# Altium schematic sheet DAC_channel.SchDoc: DAC output
size 420 x 297 mm; EDA_Number: ARTIQ; Author: G.Kasprowicz; CompanyName: WUT ISE; DrawnBy: G.Kasprowicz; Organization: WUT ISE; Address1: PW ISE; Address2: Nowowiejska 15/19 00-665 Warsaw; Address3: gkasprow@gmail.com; DocumentNumber: 5; Revision: 1.0; SheetNumber: 5; SheetTotal: 7; ModifiedBy: -; CheckedDate: -; Title2: channel; DivGrp: WUT ISE; Designer: G.Kasprowicz; ModifiedDate: -; ProjectName: Sensor Box
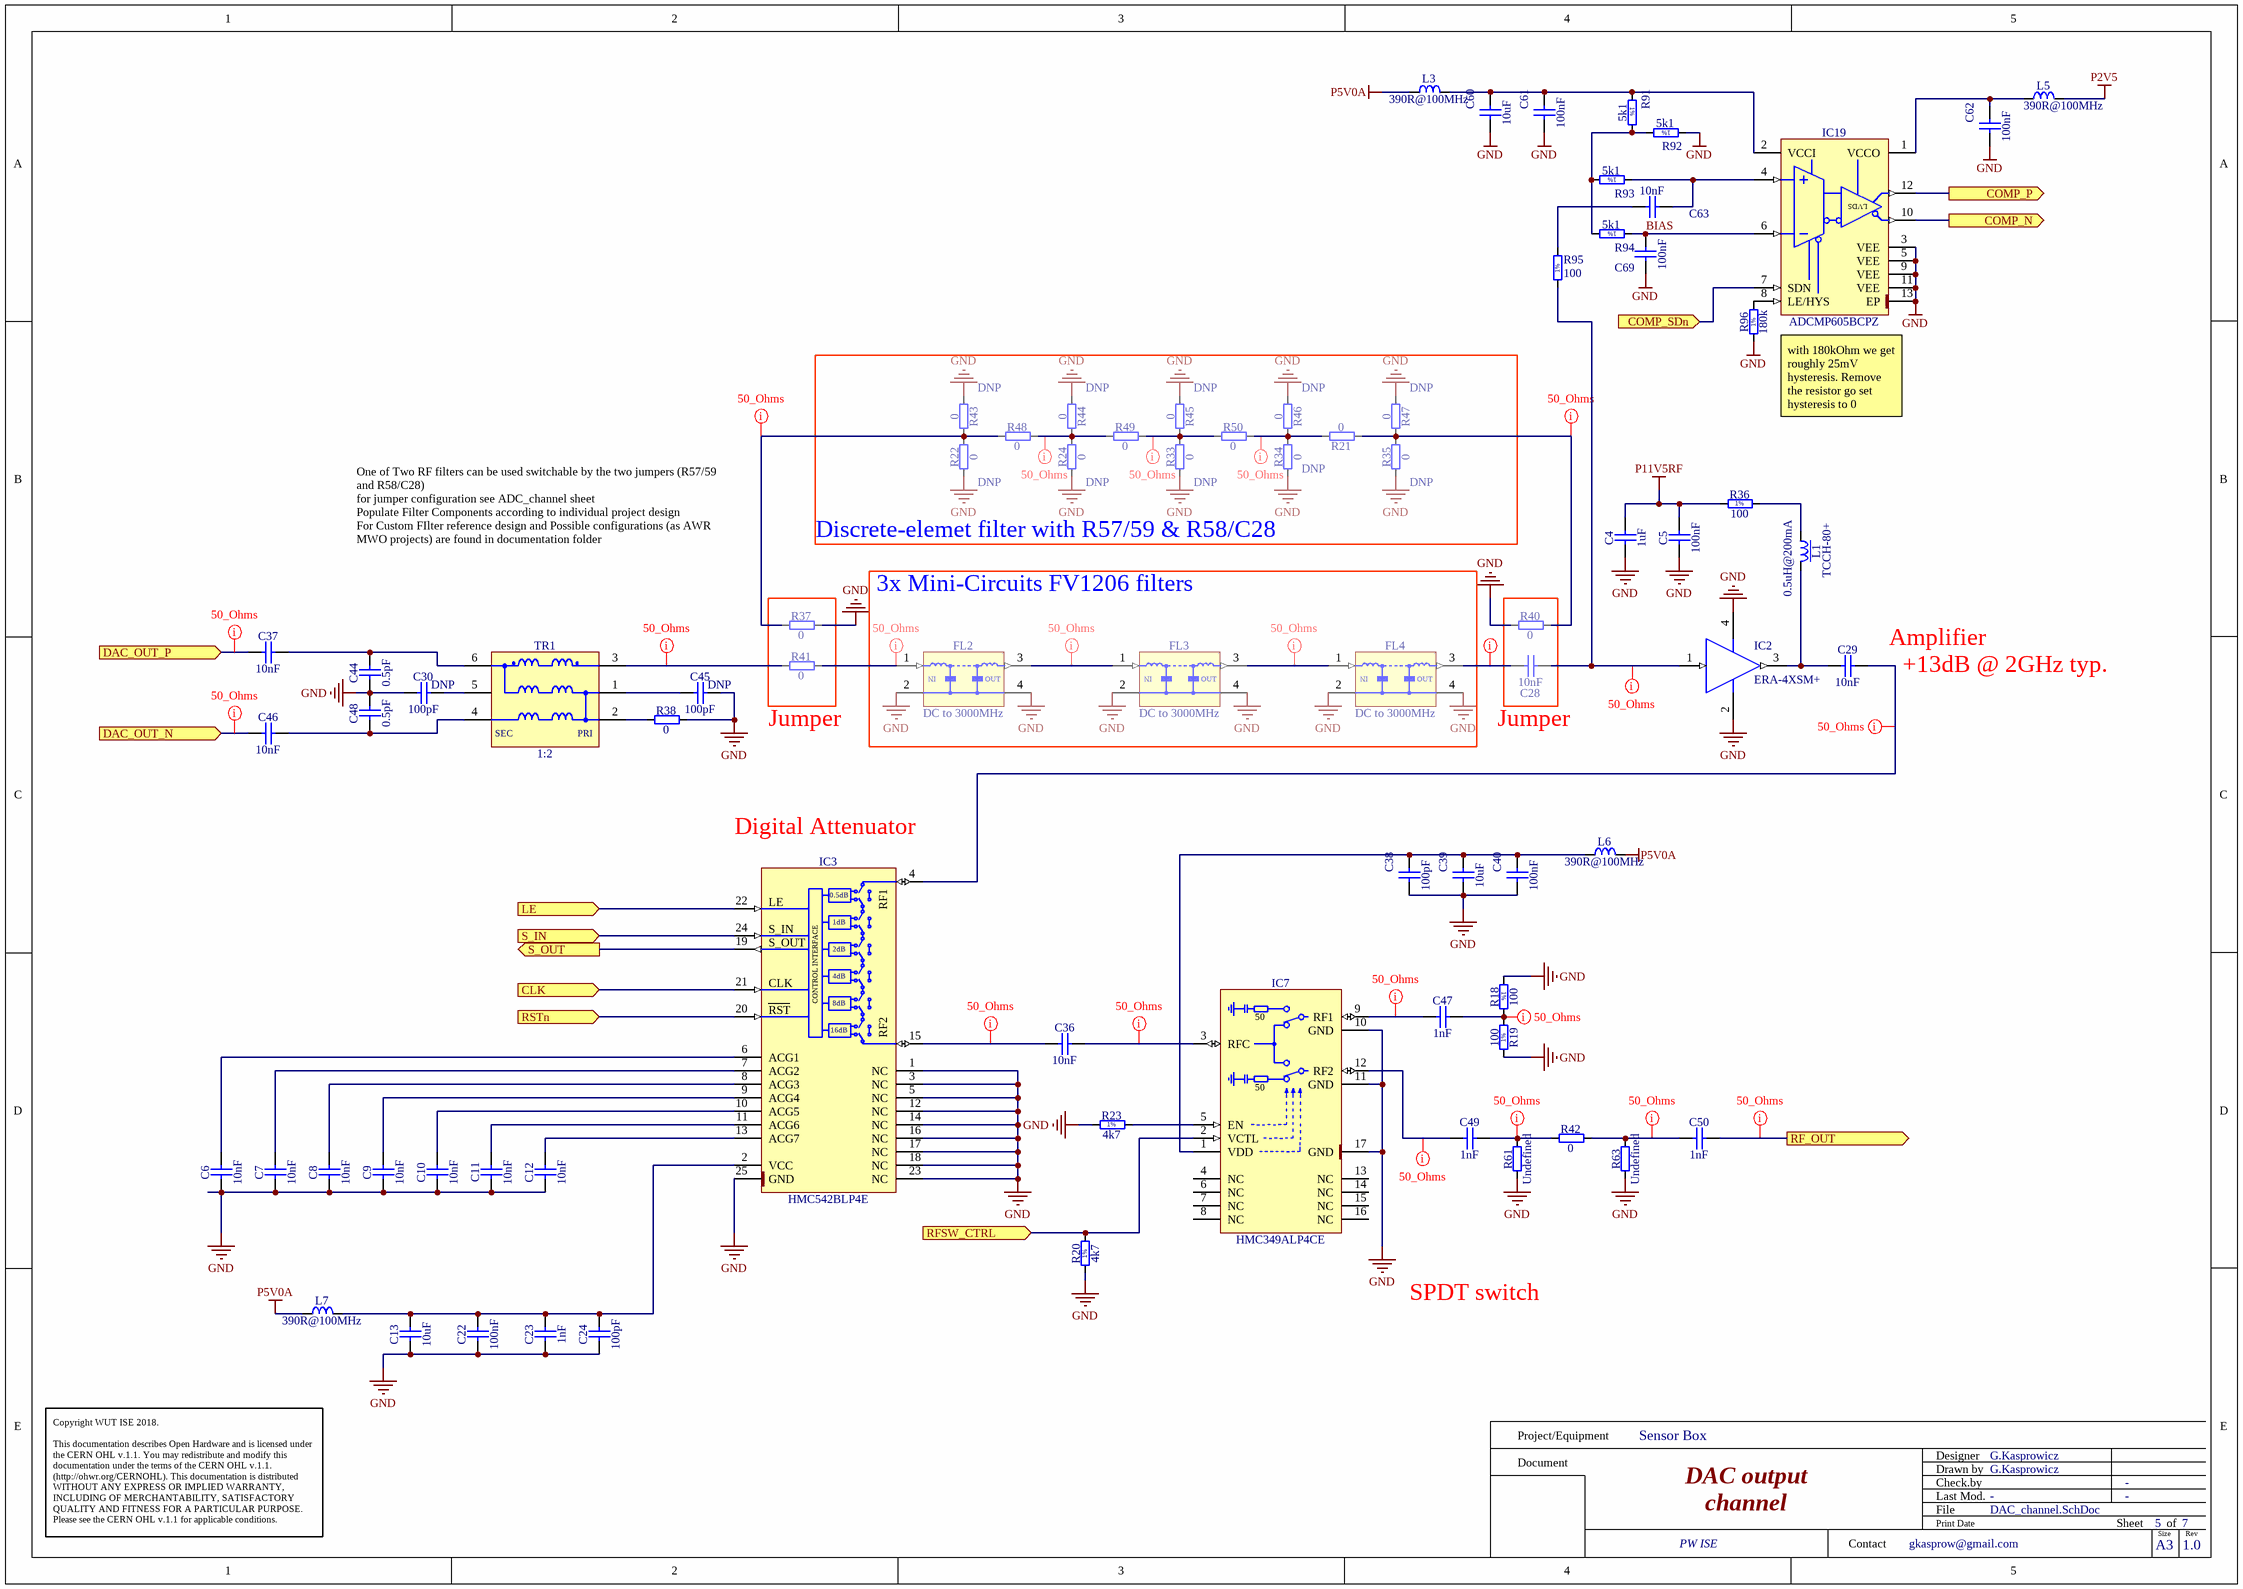
[diagram p0: DAC_channel.SchDoc]

## Parts
C4  1uF  [CAPC2012X140N]
C5  100nF  [CAPC1608X87N]
C6  10nF  [CAPC1005X55N]
C7  10nF  [CAPC1005X55N]
C8  10nF  [CAPC1005X55N]
C9  10nF  [CAPC1005X55N]
C10  10nF  [CAPC1005X55N]
C11  10nF  [CAPC1005X55N]
C12  10nF  [CAPC1005X55N]
C13  10uF  [CAPC1608X80N]
C22  100nF  [CAPC1005X55N]
C23  1nF  [CAPC1005X55N]
C24  100pF  [CAPC1005X55N]
C28  10nF  [CAPC1005X55N]
C29  10nF  [CAPC1005X55N]
C30  100pF  Mounted: DNP  [CAPC1005X55N]
C36  10nF  [CAPC1005X55N]
C37  10nF  [CAPC1005X55N]
C38  100pF  [CAPC1005X55N]
C39  10uF  [CAPC1608X80N]
C40  100nF  [CAPC1005X55N]
C44  0.5pF  [CAPC1005X50N]
C45  100pF  Mounted: DNP  [CAPC1005X55N]
C46  10nF  [CAPC1005X55N]
C47  1nF  [CAPC1005X55N]
C48  0.5pF  [CAPC1005X50N]
C49  1nF  [CAPC1005X55N]
C50  1nF  [CAPC1005X55N]
C60  10uF  [CAPC1608X80N]
C61  100nF  [CAPC1005X55N]
C62  100nF  [CAPC1005X55N]
C63  10nF  [CAPC1005X55N]
C69  100nF  [CAPC1005X55N]
FL2  DC to 3000MHz  [FIL_MINI-CIRCUITS_FV1206]
FL3  DC to 3000MHz  [FIL_MINI-CIRCUITS_FV1206]
FL4  DC to 3000MHz  [FIL_MINI-CIRCUITS_FV1206]
IC2  ERA-4XSM+  [MINI-CIRCUITS_WW107]
IC3  HMC542BLP4E  [QFN50P400X400X100-25N-S295]
IC7  HMC349ALP4CE  [QFN65P400X400X100-17N-S255]
IC19  ADCMP605BCPZ  [QFN50P300X300X100-13N-S145]
L1  0.5uH@200mA  Manufacturer Part Number: TCCH-80+  [IND_MINI-CIRCUITS_GU1604]
L3  390R@100MHz  [INDC1608X95N]
L5  390R@100MHz  [INDC1608X95N]
L6  390R@100MHz  [INDC1608X95N]
L7  390R@100MHz  [INDC1608X95N]
R18  100  [RESC1005X40N]
R19  100  [RESC1005X40N]
R20  4k7  [RESC1005X40N]
R21  0  [RESC1005X40N]
R22  0  Mounted: DNP  [RESC1005X40N]
R23  4k7  [RESC1005X40N]
R24  0  Mounted: DNP  [RESC1005X40N]
R33  0  Mounted: DNP  [RESC1005X40N]
R34  0  Mounted: DNP  [RESC1005X40N]
R35  0  Mounted: DNP  [RESC1005X40N]
R36  100  [RESC3146X65N]
R37  0  [RESC1005X40N]
R38  0  [RESC1005X40N]
R40  0  [RESC1005X40N]
R41  0  [RESC1005X40N]
R42  0  [RESC1608X55N]
R43  0  Mounted: DNP  [RESC1005X40N]
R44  0  Mounted: DNP  [RESC1005X40N]
R45  0  Mounted: DNP  [RESC1005X40N]
R46  0  Mounted: DNP  [RESC1005X40N]
R47  0  Mounted: DNP  [RESC1005X40N]
R48  0  [RESC1005X40N]
R49  0  [RESC1005X40N]
R50  0  [RESC1005X40N]
R61  Undefined  [RESC1608X55N]
R63  Undefined  [RESC1608X55N]
R91  5k1  [RESC1005X40N]
R92  5k1  [RESC1005X40N]
R93  5k1  [RESC1005X40N]
R94  5k1  [RESC1005X40N]
R95  100  [RESC1005X40N]
R96  180k  [RESC1005X40N]
TR1  1:2  [XFMR_MINI-CIRCUITS_DB1627]

## Blocks framed on the sheet
Discrete-elemet filter with R57/59 & R58/C28: R21 R22 R24 R33-R35 R43-R50
3x Mini-Circuits FV1206 filters: FL2-FL4

## Ports
CLK (in), COMP_N (out), COMP_P (out), COMP_SDn (in), DAC_OUT_N (in), DAC_OUT_P (in), LE (in), RF_OUT (out), RFSW_CTRL (in), RSTn (in), S_IN (in), S_OUT (out)

## Nets
GND: C4.1 C5.1 C6.1 C7.1 C8.1 C9.1 C10.1 C11.1 C12.1 C13.1 C22.1 C23.1 C24.1 C30.1 C38.2 C39.1 C40.1 C44.1 C45.2 C48.2 C60.1 C61.1 C62.1 C69.1 FL2.2(GND) FL2.4(GND) FL3.2(GND) FL3.4(GND) FL4.2(GND) FL4.4(GND) IC2.2(GND) IC2.4(GND) IC3.1(NC) IC3.3(NC) IC3.5(NC) IC3.12(NC) IC3.14(NC) IC3.16(NC) IC3.17(NC) IC3.18(NC) IC3.23(NC) IC3.25(GND) IC7.10(GND) IC7.11(GND) IC7.17(GND) IC19.3(VEE) IC19.5(VEE) IC19.9(VEE) IC19.11(VEE) IC19.13(EP) R18.1 R19.1 R20.1 R22.1 R23.1 R24.1 R33.1 R34.1 R35.1 R37.2 R38.2 R40.2 R43.1 R44.1 R45.1 R46.1 R47.1 R61.1 R63.1 R92.1 R96.1
P2V5: L5.2
P5V0A: L3.1 L6.2 L7.1
P11V5RF: C4.2 C5.2 R36.1
BIAS: C69.2 IC19.6(VN) R94.1
CLK: IC3.21(SHIFT_CLOCK) ; port CLK
COMP_N: IC19.10(~{Q}) ; port COMP_N
COMP_P: IC19.12(Q) ; port COMP_P
COMP_SDn: IC19.7(SDN) ; port COMP_SDn
DAC_OUT_N: C46.1 ; port DAC_OUT_N
DAC_OUT_P: C37.1 ; port DAC_OUT_P
LE: IC3.22(LATCH_ENABLE) ; port LE
RF_OUT: C50.2 ; port RF_OUT
RFSW_CTRL: IC7.2(VCTL) R20.2 ; port RFSW_CTRL
RSTn: IC3.20(~{RESET}) ; port RSTn
S_IN: IC3.24(SERIAL_INPUT) ; port S_IN
S_OUT: IC3.19(SERIAL_OUTPUT) ; port S_OUT
NetC6_2: C6.2 IC3.6(ACG1)
NetC7_2: C7.2 IC3.7(ACG2)
NetC8_2: C8.2 IC3.8(ACG3)
NetC9_2: C9.2 IC3.9(ACG4)
NetC10_2: C10.2 IC3.10(ACG5)
NetC11_2: C11.2 IC3.11(ACG6)
NetC12_2: C12.2 IC3.13(ACG7)
NetC13_2: C13.2 C22.2 C23.2 C24.2 IC3.2(VCC) L7.2
NetC28_1: C28.1 FL4.3(RFOUT)
NetC28_2: C28.2 IC2.1(RF_IN) R95.1
NetC29_1: C29.1 IC2.3(RF_OUT) L1.3
NetC29_2: C29.2 IC3.4(RF1)
NetC30_2: C30.2 TR1.5(NC)
NetC36_1: C36.1 IC3.15(RF2)
NetC36_2: C36.2 IC7.3(RFC)
NetC37_2: C37.2 C44.2 TR1.6(S1)
NetC38_1: C38.1 C39.2 C40.2 IC7.1(VDD) L6.1
NetC45_1: C45.1 TR1.1(P1)
NetC46_2: C46.2 C48.1 TR1.4(S1)
NetC47_1: C47.1 IC7.9(RF1)
NetC47_2: C47.2 R18.2 R19.2
NetC49_1: C49.1 IC7.12(RF2)
NetC49_2: C49.2 R42.1 R61.2
NetC50_1: C50.1 R42.2 R63.2
NetC60_2: C60.2 C61.2 IC19.2(VCCI) L3.2 R91.1
NetC62_2: C62.2 IC19.1(VCCO) L5.1
NetC63_1: C63.1 IC19.4(VP) R93.1
NetC63_2: C63.2 R95.2
NetFL2_1: FL2.1(RFIN) R41.2
NetFL2_3: FL2.3(RFOUT) FL3.1(RFIN)
NetFL3_3: FL3.3(RFOUT) FL4.1(RFIN)
NetIC7_5: IC7.5(EN) R23.2
NetIC19_8: IC19.8(LE/HYS) R96.2
NetL1_1: L1.1 R36.2
NetR21_1: R21.1 R35.2 R40.1 R47.2
NetR21_2: R21.2 R34.2 R46.2 R50.2
NetR22_2: R22.2 R37.1 R43.2 R48.1
NetR24_2: R24.2 R44.2 R48.2 R49.1
NetR33_2: R33.2 R45.2 R49.2 R50.1
NetR38_1: R38.1 TR1.2(P1)
NetR41_1: R41.1 TR1.3(P1)
NetR91_2: R91.2 R92.2 R93.2 R94.2

Not connected (* = marked no-connect by the designer): IC7 4(NC) 6(NC) 7(NC) 8(NC) 13(NC) 14(NC) 15(NC) 16(NC)

## Layout directives
net class 50_Ohms: DAC_OUT_N, DAC_OUT_P, NetC28_1, NetC28_2, NetC29_2, NetC36_1, NetC36_2, NetC47_1, NetC47_2, NetC49_1, NetC49_2, NetC50_1, NetFL2_1, NetFL2_3, NetFL3_3, NetR21_1, NetR21_2, NetR22_2, NetR24_2, NetR33_2, NetR41_1, RF_OUT

## Notes on the sheet
- with 180kOhm we get roughly 25mV hysteresis. Remove the resistor go set hysteresis to 0
- One of Two RF filters can be used switchable by the two jumpers (R57/59 and R58/C28)
  for jumper configuration see ADC_channel sheet
  Populate Filter Components according to individual project design
  For Custom FIlter reference design and Possible configurations (as AWR MWO projects) are found in documentation folder
- (near C29) Amplifier
- Jumper
- (near C29) +13dB @ 2GHz typ.
- (near IC3) Digital Attenuator
- SPDT switch
- Project/Equipment
- Document
- Designer
- Drawn by
- Check.by
- Copyright WUT ISE 2018.
  This documentation describes Open Hardware and is licensed under the CERN OHL v.1.1. You may redistribute and modify this documentation under the terms of the CERN OHL v.1.1. (http://ohwr.org/CERNOHL). This documentation is distributed WITHOUT ANY EXPRESS OR IMPLIED WARRANTY, INCLUDING OF MERCHANTABILITY, SATISFACTORY QUALITY AND FITNESS FOR A PARTICULAR PURPOSE. Please see the CERN OHL v.1.1 for applicable conditions.
- Contact
- File
- Last Mod.
- Print Date
- Sheet
- Size
- A3
- of
- Rev
- (in symbol ADCMP605BCPZ) LVDS
- (in symbol FIL_MINI-CIRCUITS_LFCN-3000+) IN; OUT
- (in symbol HMC349ALP4CE) 50
- (in symbol HMC542BLP4E) 0.5dB; LE; 1dB; S_IN; S_OUT; 2dB; CONTROL INTERFACE; 4dB; CLK; 8dB; RST; 16dB
- (in symbol R0402_4K7_1%_0.0625W_100PPM) 1%
- (in symbol R0402_5K1_1%_0.0625W_100PPM) 1%
- (in symbol R0402_100R_1%_0.1W_100PPM) 1%
- (in symbol R0402_100R_1%_0.0625W_100PPM) 1%
- (in symbol R0402_180K_1%_0.0625W_100PPM) 1%
- (in symbol R1218_100R_1%_1W_100PPM) 1%
- (in symbol XFMR_MINI-CIRCUITS_TCM2-43X+) SEC; PRI

## Library data of the parts
C4 = CC0805_1UF_35V_20%_X7R: Non-polarised capacitor; Part Description: SMD Multilayer Chip Ceramic Capacitor; Manufacturer: GENERIC; Manufacturer1 Part Number: GMK212B7105MG-T; Voltage: 35V; TC: X7R; Tolerance: ±20%; Part Number: CC0805_1UF_35V_20%_X7R; Component Kind: Standard; Component Type: Standard; Pin Count: 2; Value: 1uF; Status: Not Recommended; Manufacturer Part Number: CC0805_1UF_35V_20%_X7R; Case: 0805; Mounted: Yes; Socket: No; SMD: Yes; Sense: No; Manufacturer1 Example: TAIYO YUDEN; Manufacturer1 ComponentHeight: 1.35mm; HelpURL: \\cern.ch\dfs\Applications\Altium\Datasheets\CC0805_X7R_TAIYO-YUDEN_HIGH-VALUE.pdf; Author: CERN DEM JLC; CreateDate: 2011-06-22; LatestRevisionDate: 2011-06-22
C5 = CC0603_100NF_50V_10%_X7R: Non-polarised capacitor; Part Description: SMD Multilayer Chip Ceramic Capacitor; Manufacturer: GENERIC; Manufacturer1 Part Number: 223858615649; Voltage: 50V; TC: X7R; Tolerance: ±10%; Part Number: CC0603_100NF_50V_10%_X7R; Component Kind: Standard; Component Type: Standard; Pin Count: 2; Value: 100nF; Status: Preferred; Manufacturer Part Number: CC0603_100NF_50V_10%_X7R; Case: 0603; Mounted: Yes; Socket: No; SMD: Yes; Sense: No; Manufacturer1 Example: PHYCOMP; Manufacturer1 ComponentHeight: 0.87mm; HelpURL: \\cern.ch\dfs\Applications\Altium\Datasheets\CC0603_X7R_PHYCOMP.pdf; Author: CERN DEM JLC; CreateDate: 2007-12-03; LatestRevisionDate: 2007-12-03
C6-C12 C28 C29 C36 C37 C46 C63 = CC0402_10NF_16V_10%_X7R: Non-polarised capacitor; Part Description: SMD Multilayer Chip Ceramic Capacitor; Manufacturer: GENERIC; Manufacturer1 Part Number: 223878715636; Voltage: 16V; TC: X7R; Tolerance: ±10%; Part Number: CC0402_10NF_16V_10%_X7R; Component Kind: Standard; Component Type: Standard; Pin Count: 2; Value: 10nF; Status: Not Recommended; Manufacturer Part Number: CC0402_10NF_16V_10%_X7R; Case: 0402; Mounted: Yes; Socket: No; SMD: Yes; Sense: No; Manufacturer1 Example: PHYCOMP; Manufacturer1 ComponentHeight: 0.55mm; HelpURL: \\cern.ch\dfs\Applications\Altium\Datasheets\CC0402_X7R_PHYCOMP.pdf; Author: CERN DEM JLC; CreateDate: 2007-12-03; LatestRevisionDate: 2007-12-03
C13 C39 C60 = CC0603_10UF_16V_20%_X5R: Non-polarised capacitor; Part Description: SMD Multilayer Chip Ceramic Capacitor; Manufacturer: GENERIC; Manufacturer1 Part Number: GRM188R61C106MA73D; Voltage: 16V; TC: X5R; Tolerance: ±20%; Part Number: CC0603_10UF_16V_20%_X5R; Component Kind: Standard; Component Type: Standard; Pin Count: 2; Value: 10uF; Status: None; Manufacturer Part Number: CC0603_10UF_16V_20%_X5R; Case: 0603; Mounted: Yes; Socket: No; SMD: Yes; Sense: No; Manufacturer1 Example: MURATA; Manufacturer1 ComponentHeight: 0.8mm; HelpURL: \\cern.ch\dfs\Applications\Altium\Datasheets\CC0603_X5R_MURATA_GRM.pdf; Author: CERN DEM MR; CreateDate: 2016-03-02; LatestRevisionDate: 2016-03-02
C22 C40 C61 C62 C69 = CC0402_100NF_16V_10%_X7R: Non-polarised capacitor; Part Description: SMD Multilayer Chip Ceramic Capacitor; Manufacturer: GENERIC; Manufacturer1 Part Number: GRM155R71C104KA88D; Voltage: 16V; TC: X7R; Tolerance: ±10%; Part Number: CC0402_100NF_16V_10%_X7R; Component Kind: Standard; Component Type: Standard; Pin Count: 2; Value: 100nF; Status: Not Recommended; Manufacturer Part Number: CC0402_100NF_16V_10%_X7R; Case: 0402; Mounted: Yes; Socket: No; SMD: Yes; Sense: No; Manufacturer1 Example: MURATA; Manufacturer1 ComponentHeight: 0.55mm; HelpURL: \\cern.ch\dfs\Applications\Altium\Datasheets\CC0402_X7R_MURATA_GRM.pdf; Author: CERN DEM JLC; CreateDate: 2013-12-05; LatestRevisionDate: 2007-12-03
C23 C47 C49 C50 = CC0402_1NF_50V_10%_X7R: Non-polarised capacitor; Part Description: SMD Multilayer Chip Ceramic Capacitor; Manufacturer: GENERIC; Manufacturer1 Part Number: 223858715623; Voltage: 50V; TC: X7R; Tolerance: ±10%; Part Number: CC0402_1NF_50V_10%_X7R; Component Kind: Standard; Component Type: Standard; Pin Count: 2; Value: 1nF; Status: Not Recommended; Manufacturer Part Number: CC0402_1NF_50V_10%_X7R; Case: 0402; Mounted: Yes; Socket: No; SMD: Yes; Sense: No; Manufacturer1 Example: PHYCOMP; Manufacturer1 ComponentHeight: 0.55mm; HelpURL: \\cern.ch\dfs\Applications\Altium\Datasheets\CC0402_X7R_PHYCOMP.pdf; Author: CERN DEM JLC
  C23: CreateDate: 2007-12-03; LatestRevisionDate: 2007-12-03
  C47 C49 C50: CreateDate: 03.12.2007; LatestRevisionDate: 03.12.2007
C24 C30 C38 C45 = CC0402_100PF_50V_5%_C0G: Non-polarised capacitor; Part Description: SMD Multilayer Chip Ceramic Capacitor; Manufacturer: GENERIC; Manufacturer1 Part Number: C0402C101J5GACTU; Voltage: 50V; TC: C0G/NP0; Tolerance: ±5%; Part Number: CC0402_100PF_50V_5%_C0G; Component Kind: Standard; Component Type: Standard; Pin Count: 2; Value: 100pF; Status: Preferred; Manufacturer Part Number: CC0402_100PF_50V_5%_C0G; Case: 0402; Socket: No; SMD: Yes; Sense: No; Manufacturer1 Example: KEMET; Manufacturer1 ComponentHeight: 0.55mm; HelpURL: \\cern.ch\dfs\Applications\Altium\Datasheets\CC0805_C0G_KEMET_(Commercial Grade).pdf; Author: CERN DEM JLC; CreateDate: 2007-12-03; LatestRevisionDate: 2015-04-22
  C24 C38: Mounted: Yes
C44 C48 = CC0402_0.5PF_25V_0.05PF_AVX_04023J0R5ABSTR: Non-polarised capacitor; Part Description: Thin-Film Chip Capacitors for RF Signal and Power Applications, Accu-P Series; Manufacturer: AVX; Voltage: 25V; Tolerance: ±0.05pF; Part Number: CC0402_0.5PF_25V_0.05PF_AVX_04023J0R5ABSTR; Component Kind: Standard; Component Type: Standard; Pin Count: 2; Value: 0.5pF; Status: None; Manufacturer Part Number: 04023J0R5ABSTR; Case: 0402; Mounted: Yes; Socket: No; SMD: Yes; Sense: No; ComponentHeight: 0.5mm; HelpURL: \\cern.ch\dfs\Applications\Altium\Datasheets\CC0402_AVX_ACCU-P.pdf; Author: CERN DEM JLC; CreateDate: 22.02.2017; LatestRevisionDate: 22.02.2017
FL2-FL4 = FIL_MINI-CIRCUITS_LFCN-3000+: 50 Ohm DC to 3000MHz Low Pass Filter; Part Description: 50 Ohm Low Pass Filter; Part Number: FIL_MINI-CIRCUITS_LFCN-3000+; Component Kind: Standard; Component Type: Standard; Pin Count: 2; Value: DC to 3000MHz; Status: None; Manufacturer: MINI-CIRCUITS; Manufacturer Part Number: LFCN-3000+; Mounted: Yes; Socket: No; SMD: Yes; Sense: No; ComponentHeight: 0.94mm; HelpURL: \\cern.ch\dfs\Applications\Altium\Datasheets\FIL_MINI-CIRCUITS_LFCN-3000+.pdf; Author: CERN DEM JLC; CreateDate: 2013-12-09; LatestRevisionDate: 2013-12-09
IC2 = ERA-4XSM+: DC-4GHz Monolithic Amplifier; Manufacturer: MINI-CIRCUITS; PressFit: No; Bonding: No; Part Number: ERA-4XSM+; Component Kind: Standard; Component Type: Standard; Device: ERA-4XSM+; PackageDescription: MINI-CIRCUITS WW107 Case, Body 2.16mm Diameter X 1.52mm H; Part Description: DC-4GHz Monolithic Amplifier; Manufacturer Part Number: ERA-4XSM+; Pin Count: 4; Mounted: Yes; Socket: No; SMD: Yes; Sense: No; ComponentHeight: 1.52mm; Author: CERN DEM JMW; HelpURL: \\cern.ch\dfs\Applications\Altium\Datasheets\ERA-4XSM+.pdf; CreateDate: 11.08.2016; LatestRevisionDate: 11.08.2016
IC3 = HMC542BLP4E: 0.5dB LSB GaAs MMIC 6-bit Digital Serial Control Attenuator, DC - 4GHz; Part Description: 0.5dB LSB GaAs MMIC 6-bit Digital Serial Control Attenuator, DC to 4GHz; Manufacturer: HITTITE MICROWAVE CORP; PressFit: No; Bonding: No; Part Number: HMC542BLP4E; Component Kind: Standard; Component Type: Standard; Device: HMC542BLP4E; PackageDescription: QFN, 0.50mm Pitch, Square; 24 Pin, 4.00mm L X 4.00mm W X 1.00mm H Body (w/thermal Tab 2.95 X 2.95mm), IPC Medium Density; Manufacturer Part Number: HMC542BLP4E; Pin Count: 25; Case: QFN24; Mounted: Yes; Socket: No; SMD: Yes; Sense: No; ComponentHeight: 1mm; Author: CERN DEM JMW; HelpURL: \\cern.ch\dfs\Applications\Altium\Datasheets\HMC542BLP4E.pdf; CreateDate: 2016-08-17; LatestRevisionDate: 2016-08-17
IC7 = HMC349ALP4CE: DC-4GHz High Isolation SPDT Non-Reflective Switch; Manufacturer: ANALOG DEVICES; PressFit: No; Bonding: No; Part Number: HMC349ALP4CE; Component Kind: Standard; Component Type: Standard; Device: HMC349ALP4CE; PackageDescription: QFN, 0.65mm pitch,square; 4 pin X 4 pin, 4mm X 4mm X 1mm H body (w/thermal tab 2.55 X 2.55mm),  IPC Medium Density; Part Description: DC-4GHz High Isolation SPDT Non-Reflective Switch; Manufacturer Part Number: HMC349ALP4CE; Pin Count: 17; Case: QFN16; Mounted: Yes; Socket: No; SMD: Yes; Sense: No; ComponentHeight: 1mm; Author: CERN DEM JLC; HelpURL: \\cern.ch\dfs\Applications\Altium\Datasheets\HMC349ALP4CE.pdf; CreateDate: 2017-02-23; LatestRevisionDate: 2017-02-23
IC19 = ADCMP605BCPZ: Rail-to-Rail, Very Fast, 2.5 V to 5.5 V Single-Supply LVDS Comparators; Manufacturer: ANALOG DEVICES; PressFit: No; Bonding: No; Part Number: ADCMP605BCPZ; Component Kind: Standard; Component Type: Standard; Device: ADCMP605BCPZ; PackageDescription: QFN,0.50mm pitch,square;12 pin,3.00mm L X 3.00mm W X 1.00mm H body (w/Thermal Tab 1.45 X 1.45mm),  IPC Medium Density; Part Description: Rail-to-Rail, Very Fast, 2.5V to 5.5V Single-Supply LVDS Comparators; Manufacturer Part Number: ADCMP605BCPZ; Pin Count: 13; Case: QFN12; Mounted: Yes; Socket: No; SMD: Yes; Sense: No; ComponentHeight: 1.0mm; Author: CERN DEM JLC; HelpURL: \\cern.ch\dfs\Applications\Altium\Datasheets\ADCMP605BCPZ.pdf; CreateDate: 01.06.2011; LatestRevisionDate: 13.12.2011
L1 = IND_MINI-CIRCUITS_TCCH-80+: 50 Ohms, 50 to 8200 MHz RF Choke; Power: 200mA; Resistance: 0.1R; Part Number: IND_MINI-CIRCUITS_TCCH-80+; Component Kind: Standard; Component Type: Standard; Pin Count: 4; Value: 0.5uH@200mA; Status: None; Part Description: 50 Ohms, 50 to 8200 MHz RF Choke; Manufacturer: MINI-CIRCUITS; Mounted: Yes; Socket: No; SMD: Yes; Sense: No; ComponentHeight: 3.81mm; HelpURL: \\cern.ch\dfs\Applications\Altium\Datasheets\IND_MINI-CIRCUITS_TCCH-80+.pdf; Author: CERN DEM JLC; CreateDate: 2011-12-19; LatestRevisionDate: 2011-12-19
L3 L5-L7 = IND0603_TDK_MPZ1608R391A: Inductor; Part Description: SMT Chip Bead for Power Line; Manufacturer: TDK; Power: 1.2A; Resistance: 0.12R; Tolerance: ±25%; Part Number: IND0603_TDK_MPZ1608R391A; Component Kind: Standard; Component Type: Standard; Pin Count: 2; Value: 390R@100MHz; Status: None; Manufacturer Part Number: MPZ1608R391A; Case: 0603; Mounted: Yes; Socket: No; SMD: Yes; Sense: No; ComponentHeight: 0.95mm; HelpURL: \\cern.ch\dfs\Applications\Altium\Datasheets\IND0603_TDK_MPZ1608.pdf; Author: CERN DEM JLC; CreateDate: 2009-12-02; LatestRevisionDate: 2009-12-02
R18 R19 = R0402_100R_1%_0.0625W_100PPM: Resistor - 1%; Part Description: General Purpose Thick Film Chip Resistor; Manufacturer: GENERIC; Manufacturer1 Part Number: 232270671001L; TC: ±100ppm/°C; PressFit: No; Part Number: R0402_100R_1%_0.0625W_100PPM; Component Kind: Standard; Component Type: Standard; Pin Count: 2; Value: 100; Status: Not Recommended; Power: 0.0625W; Tolerance: ±1%; Manufacturer Part Number: R0402_100R_1%_0.0625W_100PPM; Case: 0402; Mounted: Yes; Sense: No; Socket: No; SMD: Yes; Manufacturer1 Example: YAGEO PHYCOMP; Manufacturer1 ComponentHeight: 0.4mm; HelpURL: \\cern.ch\dfs\Applications\Altium\Datasheets\R0402_Phycomp_RC0402.pdf; Author: CERN DEM JLC; CreateDate: 03.12.2007; LatestRevisionDate: 17.10.2012
R20 R23 = R0402_4K7_1%_0.0625W_100PPM: Resistor - 1%; Part Description: General Purpose Thick Film Chip Resistor; Manufacturer: GENERIC; Manufacturer1 Part Number: 232270674702L; TC: ±100ppm/°C; Part Number: R0402_4K7_1%_0.0625W_100PPM; Component Kind: Standard; Component Type: Standard; Pin Count: 2; Value: 4k7; Status: Not recommended; Power: 0.0625W; Tolerance: ±1%; Manufacturer Part Number: R0402_4K7_1%_0.0625W_100PPM; Case: 0402; Mounted: Yes; Sense: No; Socket: No; SMD: Yes; Manufacturer1 Example: YAGEO PHYCOMP; Manufacturer1 ComponentHeight: 0.4mm; HelpURL: \\cern.ch\dfs\Applications\Altium\Datasheets\R0402_Phycomp_RC0402.pdf; Author: CERN DEM JLC; CreateDate: 2007-12-03; LatestRevisionDate: 2012-10-17
R21 R22 R24 R33-R35 R37 R38 R40 R41 R43-R50 = R0402_0R_JUMPER: Resistor; Part Description: 1A (0.05R Max DC Resistance) Zero Ohm Jumper; Manufacturer: GENERIC; Manufacturer1 Part Number: 232270591001L; Part Number: R0402_0R_JUMPER; Component Kind: Standard; Component Type: Standard; Pin Count: 2; Value: 0; Status: Not recommended; Manufacturer Part Number: R0402_0R_JUMPER; Case: 0402; Sense: No; Socket: No; SMD: Yes; Manufacturer1 Example: YAGEO PHYCOMP; Manufacturer1 ComponentHeight: 0.4mm; HelpURL: \\cern.ch\dfs\Applications\Altium\Datasheets\R0402_Phycomp_RC0402.pdf; Author: CERN DEM JLC; CreateDate: 2007-12-03; LatestRevisionDate: 2012-10-17
  R21 R37 R38 R40 R41 R48-R50: Mounted: Yes
R36 = R1218_100R_1%_1W_100PPM: Resistor - 1%; Part Description: Thick Film Chip Resistor; Manufacturer: GENERIC; Manufacturer1 Part Number: 232273571001L or RC1218FK-07100RL; Power: 1W; TC: ±100ppm/°C; PressFit: No; Part Number: R1218_100R_1%_1W_100PPM; Component Kind: Standard; Component Type: Standard; Pin Count: 2; Value: 100; Status: Not Recommended; Tolerance: ±1%; Manufacturer Part Number: R1218_100R_1%_1W_100PPM; Case: 1218; Mounted: Yes; Sense: No; Socket: No; SMD: Yes; Manufacturer1 Example: YAGEO PHYCOMP; Manufacturer1 ComponentHeight: 0.65mm; HelpURL: \\cern.ch\dfs\Applications\Altium\Datasheets\R1218_Phycomp_RC1218.pdf; Author: CERN DEM JLC; CreateDate: 14.04.2011; LatestRevisionDate: 17.10.2012
R42 = R0603_0R_JUMPER: Resistor; Part Description: 1A (0.05R Max DC Resistance) Zero Ohm Jumper; Manufacturer: GENERIC; Manufacturer1 Part Number: NRC06Z0; PressFit: No; Part Number: R0603_0R_JUMPER; Component Kind: Standard; Component Type: Standard; Pin Count: 2; Value: 0; Status: Preferred; Manufacturer Part Number: R0603_0R_JUMPER; Case: 0603; Mounted: Yes; Sense: No; Socket: No; SMD: Yes; Manufacturer1 Example: NIC COMPONENT; Manufacturer1 ComponentHeight: 0.55mm; HelpURL: \\cern.ch\dfs\Applications\Altium\Datasheets\R0603_NIC_NRC.pdf; Author: CERN DEM JLC; CreateDate: 03.12.2007; LatestRevisionDate: 13.03.2008
R61 R63 = R0603_NO-VALUE: Resistor; Part Description: Reserved Footprint For a 0603 (1608) Chip Resistor; Mounted: No; PressFit: No; Part Number: R0603_NO-VALUE; Component Kind: Standard; Component Type: Standard; Pin Count: 2; Value: Undefined; Status: None; Manufacturer: Undefined; Manufacturer Part Number: R0603_NO-VALUE; Case: 0603; Sense: No; Socket: No; SMD: Yes; Manufacturer1 Example: Undefined; Manufacturer1 Part Number: Undefined; Manufacturer1 ComponentHeight: Undefined; HelpURL: Undefined; Author: CERN DEM JLC; CreateDate: 03.12.2007; LatestRevisionDate: 13.03.2008
R91-R94 = R0402_5K1_1%_0.0625W_100PPM: Resistor - 1%; Part Description: General Purpose Thick Film Chip Resistor; Manufacturer: GENERIC; Manufacturer1 Part Number: 232270675102L; TC: ±100ppm/°C; PressFit: No; Part Number: R0402_5K1_1%_0.0625W_100PPM; Component Kind: Standard; Component Type: Standard; Pin Count: 2; Value: 5k1; Status: Not Recommended; Power: 0.0625W; Tolerance: ±1%; Manufacturer Part Number: R0402_5K1_1%_0.0625W_100PPM; Case: 0402; Mounted: Yes; Sense: No; Socket: No; SMD: Yes; Manufacturer1 Example: YAGEO PHYCOMP; Manufacturer1 ComponentHeight: 0.4mm; HelpURL: \\cern.ch\dfs\Applications\Altium\Datasheets\R0402_Phycomp_RC0402.pdf; Author: CERN DEM JLC; CreateDate: 03.12.2007; LatestRevisionDate: 17.10.2012
R95 = R0402_100R_1%_0.1W_100PPM: Resistor - 1%; Part Description: General Purpose Thick Film Chip Resistor; Manufacturer: GENERIC; Manufacturer Part Number: R0402_100R_1%_0.1W_100PPM_50V; Manufacturer1 Part Number: ERJ2RKF1000X; Power: 0.1W; TC: ±100ppm/°C; Voltage: 50V; Part Number: R0402_100R_1%_0.1W_100PPM; Component Kind: Standard; Component Type: Standard; Pin Count: 2; Value: 100; Status: Not recommended; Tolerance: ±1%; Case: 0402; Mounted: Yes; Sense: No; Socket: No; SMD: Yes; Manufacturer1 Example: PANASONIC; Manufacturer1 ComponentHeight: 0.4mm; HelpURL: \\cern.ch\dfs\Applications\Altium\Datasheets\R0402_PANASONIC_ERJ2RK.pdf; Author: CERN DEM JLC; CreateDate: 12.12.2013; LatestRevisionDate: 03.03.2015
R96 = R0402_180K_1%_0.0625W_100PPM: Resistor - 1%; Part Description: General Purpose Thick Film Chip Resistor; Manufacturer: GENERIC; Manufacturer1 Part Number: 232270671804L; TC: ±100ppm/°C; PressFit: No; Part Number: R0402_180K_1%_0.0625W_100PPM; Component Kind: Standard; Component Type: Standard; Pin Count: 2; Value: 180k; Status: Not Recommended; Power: 0.0625W; Tolerance: ±1%; Manufacturer Part Number: R0402_180K_1%_0.0625W_100PPM; Case: 0402; Mounted: Yes; Sense: No; Socket: No; SMD: Yes; Manufacturer1 Example: YAGEO PHYCOMP; Manufacturer1 ComponentHeight: 0.4mm; HelpURL: \\cern.ch\dfs\Applications\Altium\Datasheets\R0402_Phycomp_RC0402.pdf; Author: CERN DEM JLC; CreateDate: 03.12.2007; LatestRevisionDate: 17.10.2012
TR1 = XFMR_MINI-CIRCUITS_TCM2-43X+: 50 OHMS 10 to 4000 MHz RF Transformer; Power: 0.4W; Part Number: XFMR_MINI-CIRCUITS_TCM2-43X+; Component Kind: Standard; Component Type: Standard; Pin Count: 6; Value: 1:2; Status: None; Part Description: 50 Ohms 10 to 4000MHz RF Transformer; Manufacturer: MINI-CIRCUITS; Manufacturer Part Number: TCM2-43X+; Mounted: Yes; Socket: No; Sense: No; SMD: Yes; ComponentHeight: 4.06mm; HelpURL: \\cern.ch\dfs\Applications\Altium\Datasheets\XFMR_MINI-CIRCUITS_TCM2-43X+.pdf; Author: CERN DEM BC; CreateDate: 2016-02-12; LatestRevisionDate: 2016-02-12